# EAGLE design PhotoResistor (EAGLE 7.2.0)
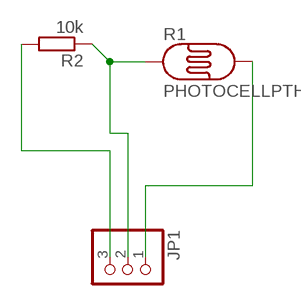
[diagram p0: schematic, sheet 1]

## Parts
JP1  PINHD-1X3/90  [1X03/90]
R1  PHOTOCELLPTH  [PHOTOCELL]
R2  10k  R-EU_0207/7  [0207/7]

## Nets
N$1: JP1.2 R1.1 R2.1
N$2: JP1.3 R2.2
N$3: JP1.1 R1.2

## Library data of the parts
JP1 = pinhead:PINHD-1X3: PIN HEADER
R1 = SparkFun-Sensors:PHOTOCELL: CdS photoresistor. This is a low cost way to detect light levels. Resistance decreases with more incoming light. SparkFun SKU: SEN-09088
R2 = rcl:R-EU_: RESISTOR, European symbol

## Board
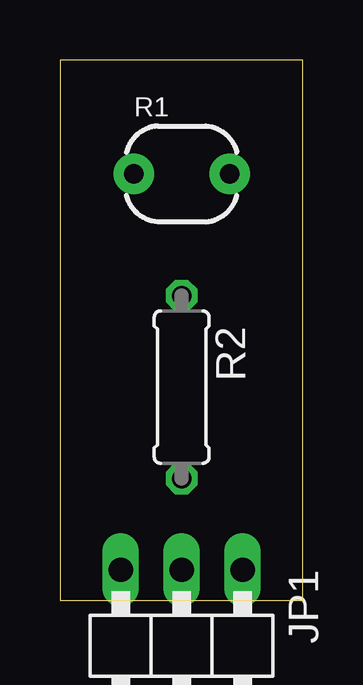
[diagram p1: board, top side]
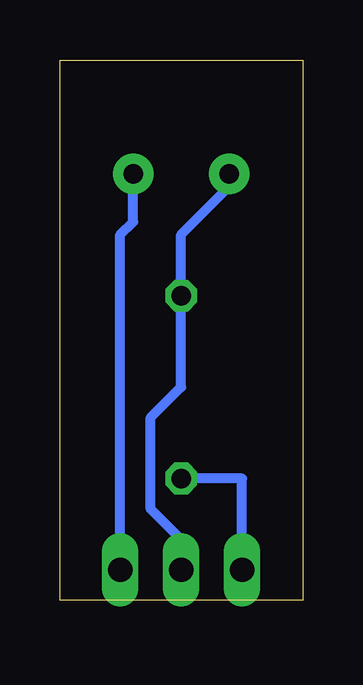
[diagram p2: board, bottom side, seen from below]

Size 10.14 x 22.53 mm. Coordinates in mm from the lower left corner, seen from the top.
Outline: 0,0 10.14,0 10.14,22.53 0,22.53 0,0
Copper layers (1*16): Top 0.035mm / dielectric 1.5mm / Bottom 0.035mm
Design rules "default": minimum track width 10mil, minimum drill 24mil, track to track 8mil, track to pad 8mil, pad to pad 8mil, via to via 8mil, smd to smd 8mil, copper to edge 40mil, drill to drill 8mil, minimum pad ring 10mil, minimum via ring 8mil, stop-mask expansion 4mil, vias tented up to drill 0mil, thermal gap 10mil

### Footprints (pad centres in the part's own frame; a part is rotated, then mirrored left to right if it is on the bottom)
1X03/90 = drill 1.016 long: 1 -2.54,-3.81; 2 0,-3.81; 3 2.54,-3.81
PHOTOCELL = drill 0.8 pad 1.676: 1 -2,0; 2 2,0
0207/7 = drill 0.813 octagon: 1 -3.81,0; 2 3.81,0

### Placement (x,y rotation side)
JP1  5.08,-2.54 180 top
R1  5.08,17.78 0 top
R2  5.08,8.89 270 top

### Tracks (layer width: path | path; a pad name or v marks a point on that pad's centre or on a via)
N$1
  Bottom 0.406: R1.1 3.08,17.24 5.08,15.24 R2.1 5.08,8.89 6.35,7.62 6.35,3.81 5.08,2.54 JP1.2
N$2
  Bottom 0.406: JP1.3 2.54,5.08 R2.2
N$3
  Bottom 0.406: JP1.1 7.62,15.24 7.08,15.78 R1.2